# EAGLE design ROSPIN School Payload v2 (EAGLE 9.6.2)
DESIGNER: CDOSR; VERSION: v10
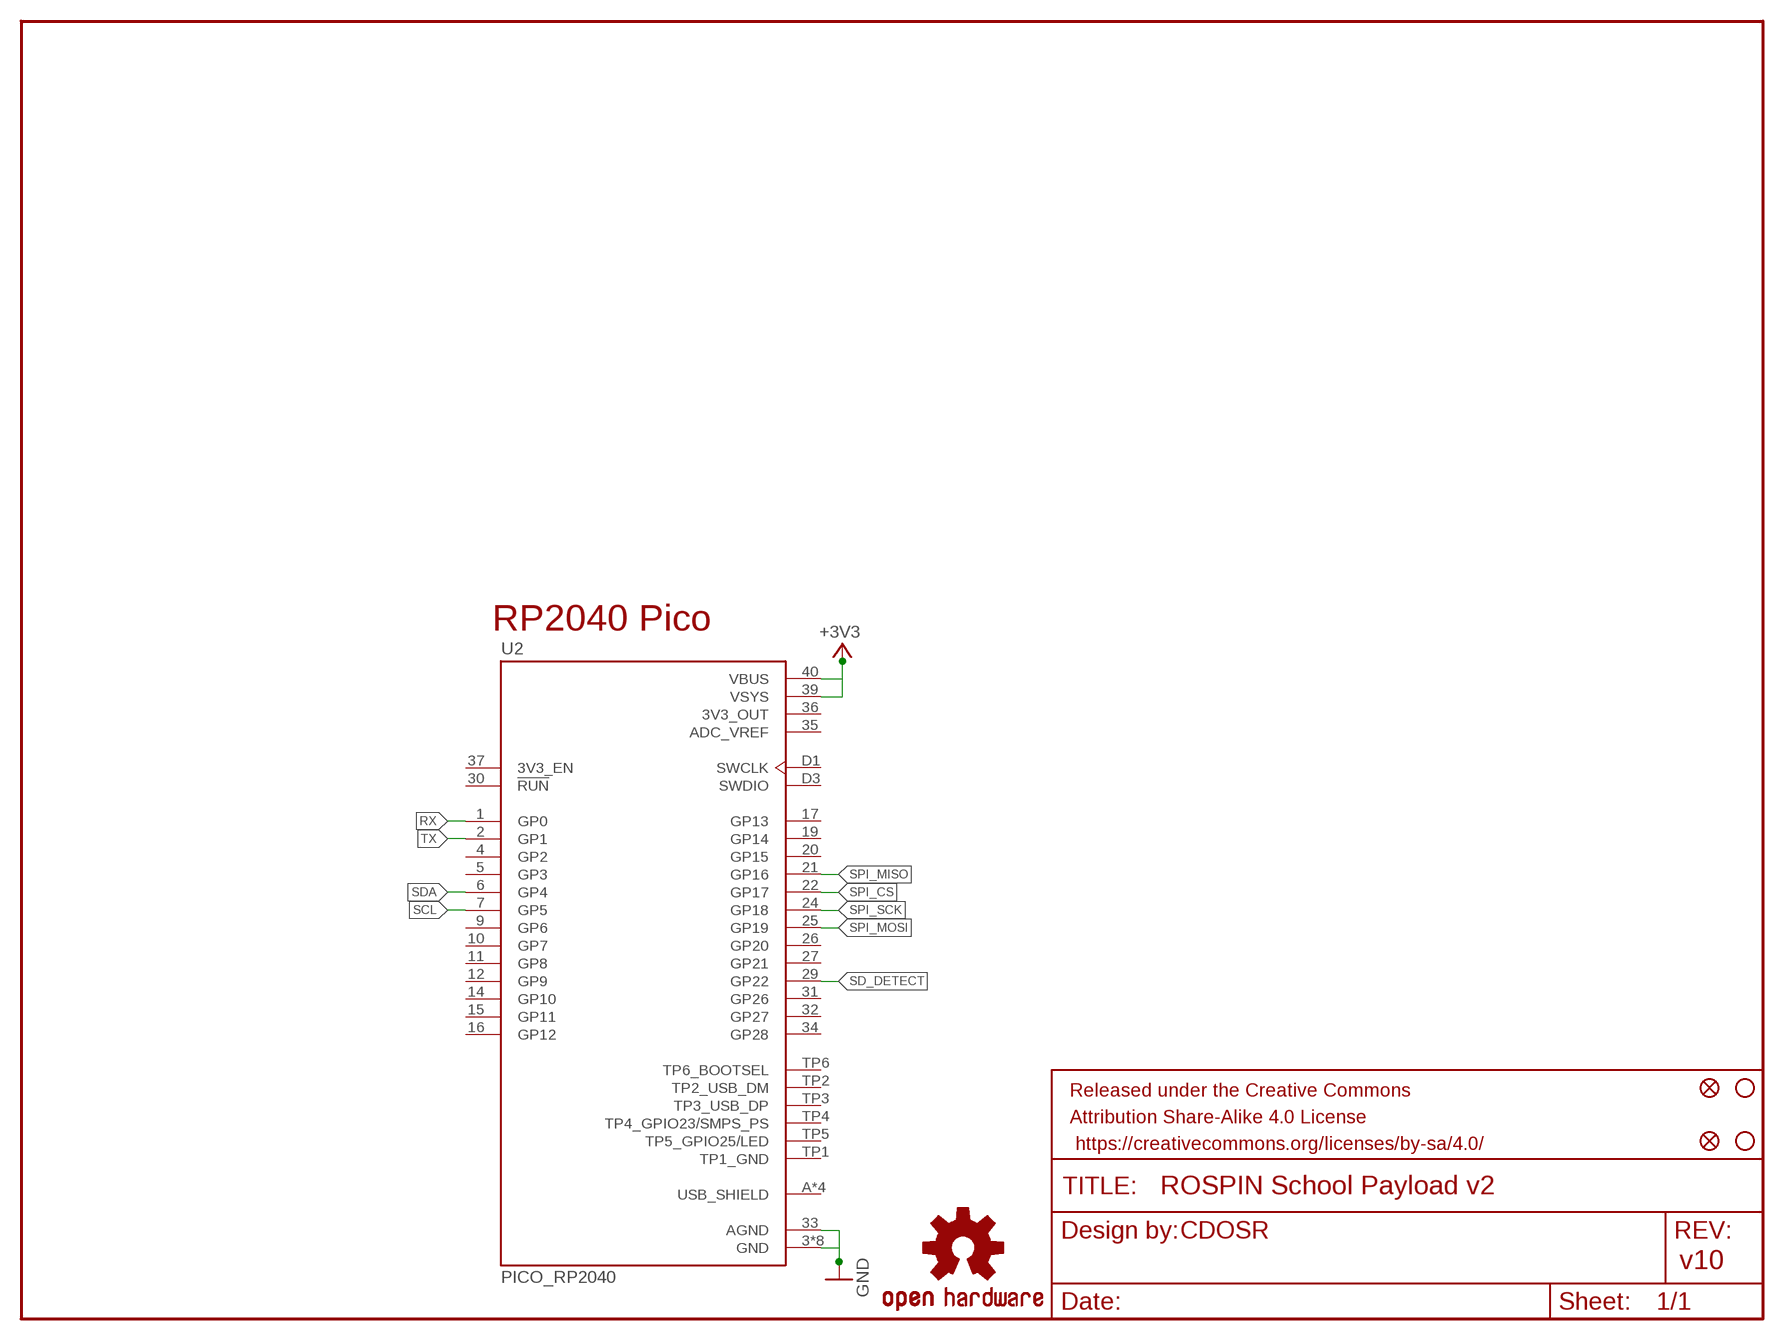
[diagram p0: schematic, sheet 1]

## Parts
FID1  FIDUCIAL1X2  [FIDUCIAL-1X2]
FID2  FIDUCIAL1X2  [FIDUCIAL-1X2]
FRAME1  FRAME-LETTER  [CREATIVE_COMMONS]
LOGO2  OSHW-LOGOS  [OSHW-LOGO-S]
STANDOFF1  STAND-OFF  [STAND-OFF]
STANDOFF2  STAND-OFF  [STAND-OFF]
U2  PICO_RP2040  [MODULE_PICO_RP2040]

## Nets
+3V3: U2.39(VSYS) U2.40(VBUS)
GND: U2.3(GND) U2.8(GND) U2.13(GND) U2.18(GND) U2.23(GND) U2.28(GND) U2.33(AGND) U2.38(GND) U2.D2(GND)
RX: U2.1(GP0)
SCL: U2.7(GP5)
SD_DETECT: U2.29(GP22)
SDA: U2.6(GP4)
SPI_CS: U2.22(GP17)
SPI_MISO: U2.21(GP16)
SPI_MOSI: U2.25(GP19)
SPI_SCK: U2.24(GP18)
TX: U2.2(GP1)
Unconnected: U2.4(GP2) U2.5(GP3) U2.9(GP6) U2.10(GP7) U2.11(GP8) U2.12(GP9) U2.14(GP10) U2.15(GP11) U2.16(GP12) U2.17(GP13) U2.19(GP14) U2.20(GP15) U2.26(GP20) U2.27(GP21) U2.30(!RUN) U2.31(GP26) U2.32(GP27) U2.34(GP28) U2.37(3V3_EN) U2.D1(SWCLK) U2.D3(SWDIO) U2.TP2(TP2_USB_DM) U2.TP3(TP3_USB_DP) U2.TP4(TP4_GPIO23/SMPS_PS) U2.TP5(TP5_GPIO25/LED) U2.TP6(TP6_BOOTSEL)

## Notes on the sheet
- RP2040 Pico

## Power pins joined to a net without a drawn wire
3V3_OUT: U2.36(3V3_OUT)
ADC_VREF: U2.35(ADC_VREF)
TP1_GND: U2.TP1(TP1_GND)
USB_SHIELD: U2.A(USB_SHIELD) U2.B(USB_SHIELD) U2.C(USB_SHIELD) U2.D(USB_SHIELD)

## Library data of the parts
FID1 FID2 = SparkFun-Aesthetics:FIDUCIAL: Fiducial Alignment Points Various fiducial points for machine vision alignment.
FRAME1 = SparkFun-Aesthetics:FRAME-LETTER: Schematic Frame Standard 8.5x11 US Letter frame
LOGO2 = SparkFun-Aesthetics:OSHW-LOGO: Open Source Hardware Logo This logo indicates the piece of hardware it is found on incorporates a OSHW license and/or adheres to the definition of open source hardware found here: http://freedomdefined.org/OSHW
STANDOFF1 STANDOFF2 = SparkFun-Electromechanical:STAND-OFF: #4 Stand Off This is the mechanical footprint for a #4 phillips button head screw. Use the keepout ring to avoid running the screw head into surrounding components. SKU : PRT-00447
U2 = pico_rp2040:PICO_RP2040: Check availability <https://pricing.snapeda.com/parts/SC0915/Raspberry%20Pi/view-part?ref=eda>; AVAILABILITY: In Stock; DESCRIPTION: RP2040 Raspberry Pi Pico series ARM® Cortex®-M0+ MCU 32-Bit Embedded Evaluation Board; MF: Raspberry Pi; MP: SC0915; PACKAGE: None; PRICE: None; PURCHASE-URL: https://pricing.snapeda.com/search/part/SC0915/?ref=eda

## Net classes
0 Default: width 0.203 mm
1 highpower: width 0.305 mm, drill 0.483 mm
2 lowpower: width 0.254 mm, drill 0.483 mm

## Board
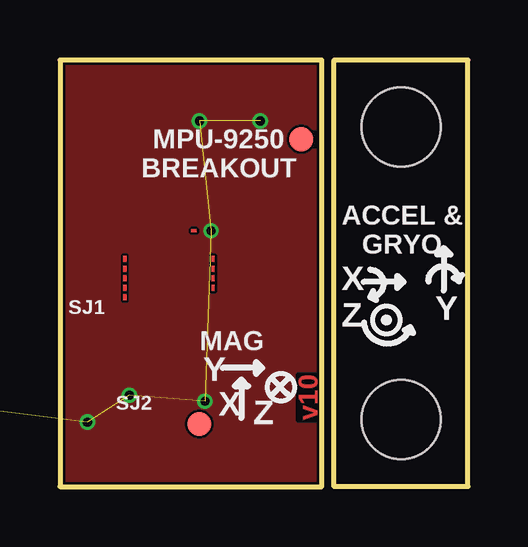
[diagram p1: board, top side]
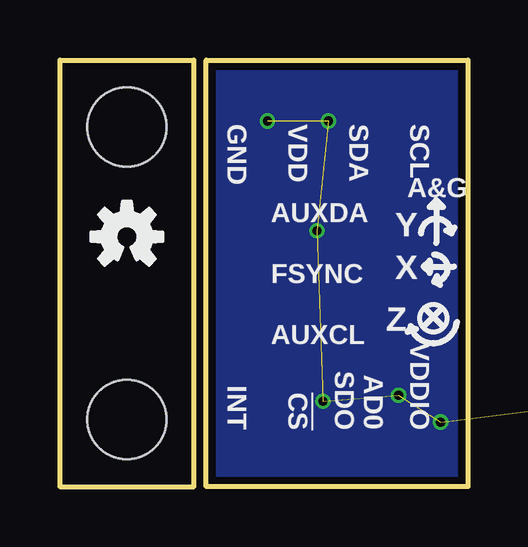
[diagram p2: board, bottom side, seen from below]

Size 17.02 x 17.78 mm. Coordinates in mm from the lower left corner, seen from the top.
Outline: 0,0 10.92,0 10.92,17.78 0,17.78 0,0
Outline: 11.43,0 11.43,17.78 17.02,17.78 17.02,0 11.43,0
Copper layers (1*16): Top 0.035mm / dielectric 1.5mm / Bottom 0.035mm
Design rules "SparkFun-2-layer-FAB-LIMIT": minimum track width 4mil, minimum drill 6mil, track to track 4mil, track to pad 4mil, pad to pad 4mil, via to via 4mil, smd to smd 4mil, copper to edge 4mil, drill to drill 4mil, minimum pad ring 5mil, minimum via ring 5mil, stop-mask expansion 4mil, vias tented up to drill 20mil, thermal gap 10mil

### Footprints (pad centres in the part's own frame; a part is rotated, then mirrored left to right if it is on the bottom)
FIDUCIAL-1X2 = smd 1 x 1: 1 0,0
STAND-OFF = hole 3.302: 0,0
MODULE_PICO_RP2040 = smd 1 x 1: 1 -9.69,24.13; 2 -9.69,21.59; 3 -9.69,19.05; 4 -9.69,16.51; 5 -9.69,13.97; 6 -9.69,11.43; 7 -9.69,8.89; 8 -9.69,6.35; 9 -9.69,3.81; 10 -9.69,1.27; 11 -9.69,-1.27; 12 -9.69,-3.81; 13 -9.69,-6.35; 14 -9.69,-8.89; 15 -9.69,-11.43; 16 -9.69,-13.97; 17 -9.69,-16.51; 18 -9.69,-19.05; 19 -9.69,-21.59; 20 -9.69,-24.13; 21 9.69,-24.13; 22 9.69,-21.59; 23 9.69,-19.05; 24 9.69,-16.51; 25 9.69,-13.97; 26 9.69,-11.43; 27 9.69,-8.89; 28 9.69,-6.35; 29 9.69,-3.81; 30 9.69,-1.27; 31 9.69,1.27; 32 9.69,3.81; 33 9.69,6.35; 34 9.69,8.89; 35 9.69,11.43; 36 9.69,13.97; 37 9.69,16.51; 38 9.69,19.05; 39 9.69,21.59; 40 9.69,24.13; D1 -2.54,-24.7; D2 0,-24.7; D3 2.54,-24.7 | smd 1.1 x 1.8: A -2.725,24; B 2.725,24 | smd 1.05 x 1.45: C -2.425,20.97; D 2.425,20.97 | smd 1.5 x 1.5: TP1 0,21; TP2 1,24.3; TP3 -1,24.3; TP4 -2.5,17.5; TP5 -2.5,15; TP6 -2.5,12.5

### Placement (x,y rotation side)
FID1  10.06,14.48 0 top
FID2  5.82,2.62 0 top
FRAME1  -21.87,-13.41 0 top  (outside the outline)
LOGO2  14.22,10.41 0 bottom
STANDOFF1  14.22,2.79 0 top
STANDOFF2  14.22,14.99 0 top
U2  -54.36,14.78 0 top  (outside the outline)

### Tracks (layer width: path | path; a pad name or v marks a point on that pad's centre or on a via)
+3V3  (1 unrouted)
GND  (via drill 0.38)  (14 unrouted)
  other vias: 6.05,3.56 2.9,3.81 6.3,10.67 1.14,2.69 8.36,15.24 5.82,15.24
  pour Top: -0.03,17.81 10.9,17.78 10.9,0 0,0
  pour Bottom (isolate 0.305): 0,0 10.92,0 10.92,17.78 0,17.78
USB_SHIELD  (3 unrouted)
(copper drawn outside any net)
  shapes: Top area x10

### Text on the board
tPlace: MPU-9250 / BREAKOUT | ACCEL & / GRYO | SJ1 | X | Z | Y | MAG | SJ2 | Y | X | Z
bPlace: SCL | SDA | VDD | GND | A&G | AUXDA | Y | X | FSYNC | Z | AUXCL | VDDIO | AD0 / SDO | !CS | INT
Measures: All units in inch
tDocu: V-score for the end user if they want to / remove more than 1/3 of the board size | Don't cut v-score in production!